# Altium schematic sheet driver_lift.SchDoc
size C
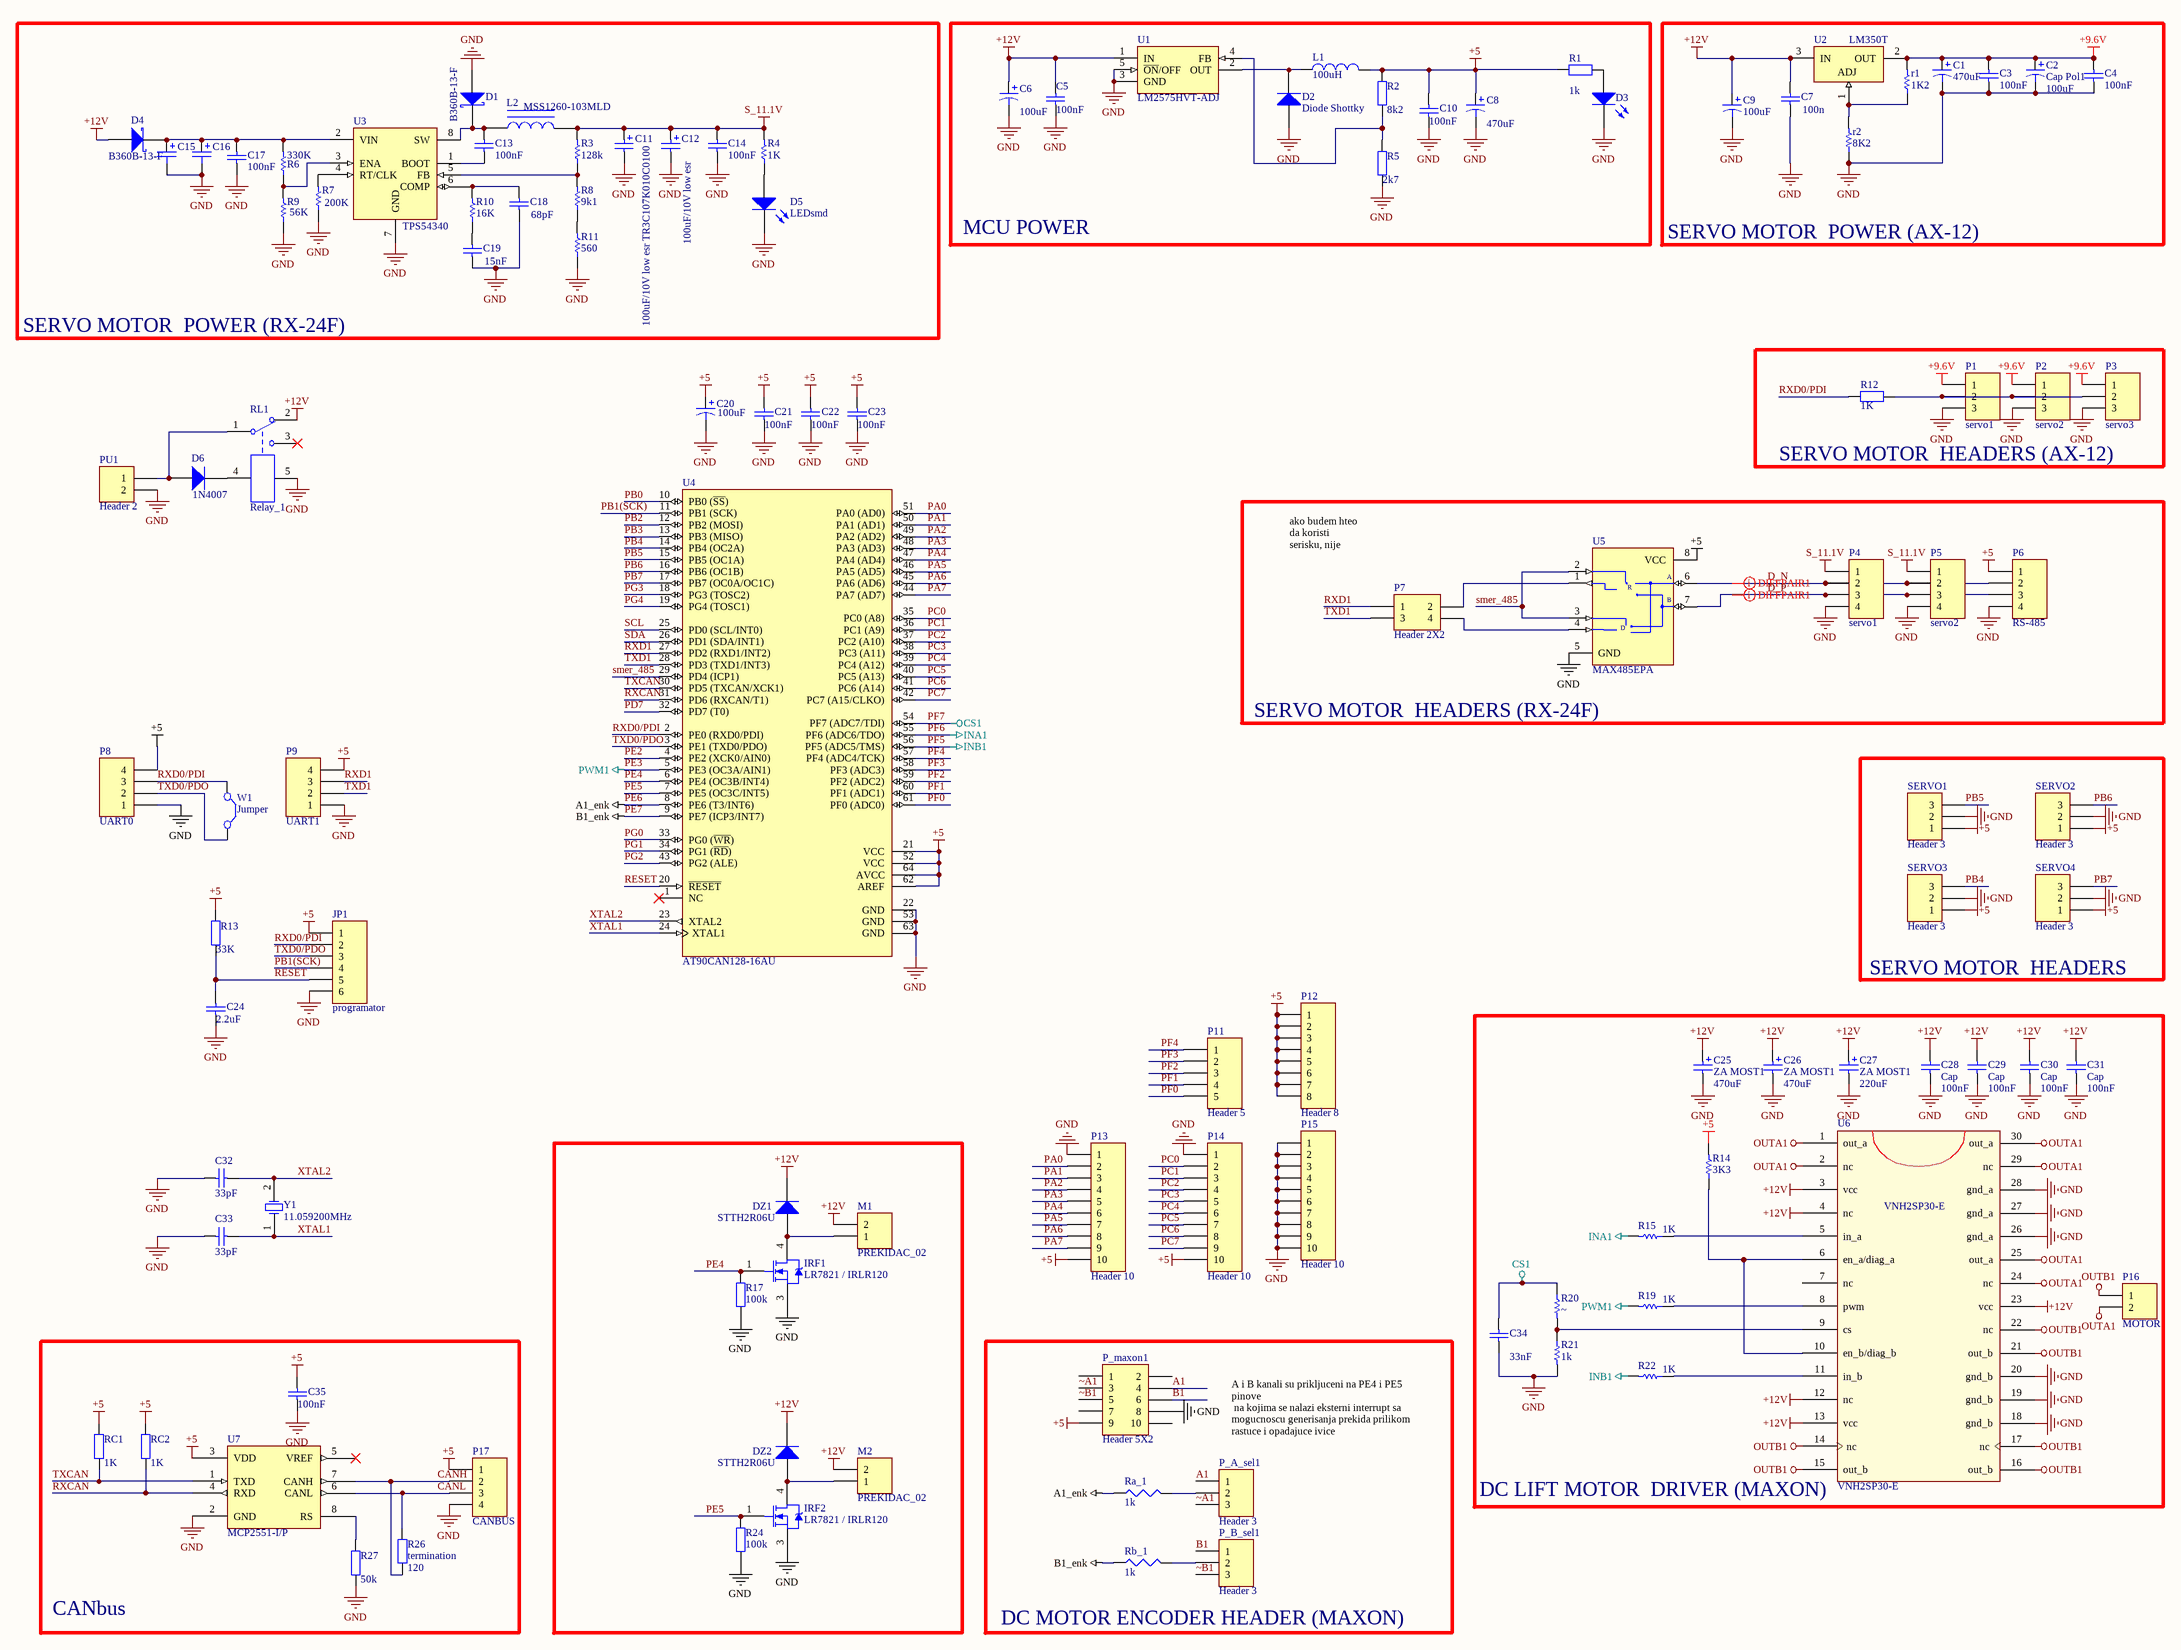
[diagram p0: driver_lift.SchDoc]

## Parts
(Parts that share a designator on the sheet are numbered #1, #2 ... from top to bottom, then left to right.)
C1  value 470uF  [B]  (hidden comment: Cap Pol1)
C2  Cap Pol1  value 100uF  [B]
C3  value 100nF  [1206]  (hidden comment: Cap)
C4  value 100nF  [1206]  (hidden comment: Cap)
C5  100nF  [1206]
C6  100uF  [B]
C7  value 100n  [1206]  (hidden comment: Cap)
C8  470uF  [CAPPR5-5x5]
C9  100uF  [B]
C10  100nF  [1206]
C11  value 100uF/10V low esr TR3C107K010C0100  [TC7343-2917]  (hidden comment: CapTantalum)
C12  value 100uF/10V low esr  [TC7343-2917]  (hidden comment: Cap Pol2)
C13  value 100nF  [1206_cap]  (hidden comment: cap_smd1206)
C14  value 100nF  [1206_cap]  (hidden comment: cap_smd1206)
C15  cap-smd1812  [cap_smd1812]  (value not drawn)
C16  cap-smd1812  [cap_smd1812]  (value not drawn)
C17  100nF  [1206_cap]
C18  value 68pF  [1206_cap]  (hidden comment: cap_smd1206)
C19  value 15nF  [1206_cap]  (hidden comment: cap_smd1206)
C20  100uF  [B]
C21  100nF  [1206]
C22  100nF  [1206]
C23  100nF  [1206]
C24  2.2uF  [1206]
C25  ZA MOST1  value 470uF  [DSO-C2/X2.3]
C26  ZA MOST1  value 470uF  [DSO-C2/X2.3]
C27  ZA MOST1  value 220uF  [DSO-C2/X2.3]
C28  Cap  value 100nF  [1206]
C29  Cap  value 100nF  [1206]
C30  Cap  value 100nF  [1206]
C31  Cap  value 100nF  [1206]
C32  33pF  [1206]
C33  33pF  [1206]
C34  value 33nF  [1206]  (hidden comment: Cap)
C35  100nF  [1206]
D1  B360B-13-F  [DSO-C2/X3.3]
D2  Diode Shottky  [DO-41]
D3  LED3  [1206]  (value not drawn)
D4  B360B-13-F  [DSO-C2/X3.3]
D5  LEDsmd  [led1206]
D6  1N4007  [DO-41]
DZ1  STTH2R06U  [DSO-C2/X2.3]
DZ2  STTH2R06U  [DSO-C2/X2.3]
IRF1  LR7821 / IRLR120  [TO252]
IRF2  LR7821 / IRLR120  [TO252]
JP1  programator  [HDR1X6]
L1  value 100uH  [AXIAL-0.4]  (hidden comment: Inductor)
L2  value MSS1260-103MLD  [INDUCTOR_SS1260-103MLD]  (hidden comment: Inductor_MSS1260)
M1  PREKIDAC_02  [kombinacija]
M2  PREKIDAC_02  [kombinacija]
P1  servo1  [HDR1X3]
P2  servo2  [HDR1X3]
P3  servo3  [HDR1X3]
P4  servo1  [HDR1X4]
P5  servo2  [HDR1X4]
P6  RS-485  [HDR1X4]
P7  Header 2X2  [HDR2X2]
P8  UART0  [HDR1X4]
P9  UART1  [HDR1X4]
P11  Header 5  [HDR1X5]
P12  Header 8  [HDR1X8]
P13  Header 10  [HDR1X10]
P14  Header 10  [HDR1X10]
P15  Header 10  [HDR1X10]
P16  MOTOR1  [kombinacija]
P17  CANBUS  [HDR1X4]
P_A_sel1  Header 3  [HDR1X3]
P_B_sel1  Header 3  [HDR1X3]
P_maxon1  Header 5X2  [box_header]
PU1  Header 2  [kon-zakacaljkax2]
R1#1  1k  [1206]
r1#2  value 1K2  [1206]  (hidden comment: Res1)
R2#1  8k2  [1206]
r2#2  value 8K2  [1206]  (hidden comment: Res1)
R3  value 128k  [1206_res]  (hidden comment: res)
R4  value 1K  [1206_res]  (hidden comment: res)
R5  2k7  [1206]
R6  value 330K  [1206_res]  (hidden comment: res)
R7  value 200K  [1206_res]  (hidden comment: res)
R8  value 9k1  [1206_res]  (hidden comment: res)
R9  value 56K  [1206_res]  (hidden comment: res)
R10  value 16K  [1206_res]  (hidden comment: res)
R11  value 560  [1206_res]  (hidden comment: res)
R12  value 1K  [1206]  (hidden comment: Res2)
R13  33k  [1206]
R14  value 3K3  [1206]  (hidden comment: res)
R15  value 1K  [1206]  (hidden comment: res)
R17  value 100k  [1206]  (hidden comment: Res2)
R19  value 1K  [1206]  (hidden comment: res)
R20  value ~  [1206]  (hidden comment: res)
R21  value 1k  [1206]  (hidden comment: res)
R22  value 1K  [1206]  (hidden comment: res)
R24  value 100k  [1206]  (hidden comment: Res2)
R26  termination  value 120  [1206]
R27  50k  [1206]
Ra_1  1k  [1206]
Rb_1  1k  [1206]
RC1  1K  [1206]
RC2  1k  [1206]
RL1  Relay_1  [RELEJ SMRDLJIVI]
SERVO1  Header 3  [HDR1X3]
SERVO2  Header 3  [HDR1X3]
SERVO3  Header 3  [HDR1X3]
SERVO4  Header 3  [HDR1X3]
U1  LM2575HVT-ADJ  [TO-263(5)]
U2  LM350T  [T03B]
U3  TPS54340  [SOIC_8PIN]
U4  AT90CAN128-16AU  [TQFP80P1600X1600X110-64L]
U5  MAX485EPA  [DIP-8]
U6  VNH2SP30-E  [vnh_test1]
U7  MCP2551-I/P  [SOIC_8PIN]
W1  Jumper  [RAD-0.1]
Y1  11.059200MHz  [RAD-0.2]

## Blocks framed on the sheet
SERVO MOTOR  POWER (RX-24F): C11-C19 D1 D4 D5 L2 R3 R4 R6-R11 U3
MCU POWER: C5 C6 C8 C10 D2 D3 L1 R1#1 R2#1 R5 U1
SERVO MOTOR  POWER (AX-12): C1-C4 C7 C9 r1#2 r2#2 U2
SERVO MOTOR  HEADERS (AX-12): P1-P3 R12
SERVO MOTOR  HEADERS (RX-24F): P4-P7 U5
SERVO MOTOR  HEADERS: SERVO1-SERVO4
DC LIFT MOTOR  DRIVER (MAXON): C25-C31 C34 P16 R14 R15 R19-R22 U6
CANbus: C35 P17 R26 R27 RC1 RC2 U7
DC MOTOR ENCODER HEADER (MAXON): P_A_sel1 P_B_sel1 P_maxon1 Ra_1 Rb_1

## Nets
+5: C8.1 C10.2 C20.1 C21.2 C22.2 C23.2 C35.2 JP1.1 L1.2 P6.1 P8.4 P9.4 P12.1 P12.2 P12.3 P12.4 P12.5 P12.6 P12.7 P12.8 P13.10 P14.10 P17.1 P_maxon1.9 R1#1.1 R2#1.2 R13.2 R14.2 RC1.2 RC2.2 SERVO1.1 SERVO2.1 SERVO3.1 SERVO4.1 U4.21(VCC) U4.52(VCC) U4.62(AREF) U4.64(AVCC) U5.8(VCC) U7.3(VDD)
+9.6V: C1.1 C2.1 C3.2 C4.2 P1.1 P2.1 P3.1 r1#2.2 U2.2(OUT)
+12V: C5.2 C6.1 C7.2 C9.1 C25.1 C26.1 C27.1 C28.2 C29.2 C30.2 C31.2 D4.1(A) DZ1.2(K) DZ2.2(K) M1.2 M2.2 RL1.2 U1.1(IN) U2.3(IN) U6.3(vcc) U6.4(nc) U6.12(nc) U6.13(vcc) U6.23(vcc)
GND: C1.2 C2.2 C3.1 C4.1 C5.1 C6.2 C7.1 C8.2 C9.2 C10.1 C11.2 C12.2 C14.1 C15.2 C16.2 C17.1 C18.1 C19.1 C20.2 C21.1 C22.1 C23.1 C24.1 C25.2 C26.2 C27.2 C28.1 C29.1 C30.1 C31.1 C32.2 C33.2 C34.1 C35.1 D1.1(A) D2.1(A) D3.2(K) D5.2(K) IRF1.3(S) IRF2.3(S) JP1.6 P1.3 P2.3 P3.3 P4.4 P5.4 P6.4 P8.1 P9.1 P13.1 P14.1 P15.1 P15.2 P15.3 P15.4 P15.5 P15.6 P15.7 P15.8 P15.9 P15.10 P17.4 P_maxon1.8 PU1.2 r2#2.1 R5.1 R7.1 R9.1 R11.1 R17.2 R21.2 R24.2 R27.1 RL1.5 SERVO1.2 SERVO2.2 SERVO3.2 SERVO4.2 U1.3(GND) U1.5(~{ON}/OFF) U3.7(GND) U4.22(GND) U4.53(GND) U4.63(GND) U5.5(GND) U6.18(gnd_b) U6.19(gnd_b) U6.20(gnd_b) U6.26(gnd_a) U6.27(gnd_a) U6.28(gnd_a) U7.2(GND)
OUTA1: P16.2 U6.1(out_a) U6.2(nc) U6.24(nc) U6.25(out_a) U6.29(nc) U6.30(out_a)
OUTB1: P16.1 U6.14(nc) U6.15(out_b) U6.16(out_b) U6.17(nc) U6.21(out_b) U6.22(nc)
PE3: R19.2 U4.5(PE3_(OC3A/AIN1))  [also labelled PWM1]
PE6: Ra_1.1 U4.8(PE6_(T3/INT6))  [also labelled A1_enk]
PE7: Rb_1.1 U4.9(PE7_(ICP3/INT7))  [also labelled B1_enk]
PF5: R22.2 U4.56(PF5_(ADC5/TMS))  [also labelled INB1]
PF6: R15.2 U4.55(PF6_(ADC6/TDO))  [also labelled INA1]
PF7: C34.2 R20.1 U4.54(PF7_(ADC7/TDI))  [also labelled CS1]
S_11.1V: C11.1 C12.1 C14.2 L2.2 P4.1 P5.1 R3.2 R4.2
A1: P_A_sel1.1 P_maxon1.4
B1: P_B_sel1.1 P_maxon1.6
CANH: P17.2 R26.2 U7.7(CANH)
CANL: P17.3 R26.1 U7.6(CANL)
D_N: P4.2 P5.2 P6.2 U5.6(A)
D_P: P4.3 P5.3 P6.3 U5.7(B)
PA0: P13.2 U4.51(PA0_(AD0))
PA1: P13.3 U4.50(PA1_(AD1))
PA2: P13.4 U4.49(PA2_(AD2))
PA3: P13.5 U4.48(PA3_(AD3))
PA4: P13.6 U4.47(PA4_(AD4))
PA5: P13.7 U4.46(PA5_(AD5))
PA6: P13.8 U4.45(PA6_(AD6))
PA7: P13.9 U4.44(PA7_(AD7))
PB0: U4.10(PB0_(~{SS}))
PB1(SCK): JP1.4 U4.11(PB1_(SCK))
PB2: U4.12(PB2_(MOSI))
PB3: U4.13(PB3_(MISO))
PB4: SERVO3.3 U4.14(PB4_(OC2A))
PB5: SERVO1.3 U4.15(PB5_(OC1A))
PB6: SERVO2.3 U4.16(PB6_(OC1B))
PB7: SERVO4.3 U4.17(PB7_(OC0A/OC1C))
PC0: P14.2 U4.35(PC0_(A8))
PC1: P14.3 U4.36(PC1_(A9))
PC2: P14.4 U4.37(PC2_(A10))
PC3: P14.5 U4.38(PC3_(A11))
PC4: P14.6 U4.39(PC4_(A12))
PC5: P14.7 U4.40(PC5_(A13))
PC6: P14.8 U4.41(PC6_(A14))
PC7: P14.9 U4.42(PC7_(A15/CLKO))
PD7: U4.32(PD7_(T0))
PE2: U4.4(PE2_(XCK0/AIN0))
PE4: IRF1.1(G) R17.1 U4.6(PE4_(OC3B/INT4))
PE5: IRF2.1(G) R24.1 U4.7(PE5_(OC3C/INT5))
PF0: P11.5 U4.61(PF0_(ADC0))
PF1: P11.4 U4.60(PF1_(ADC1))
PF2: P11.3 U4.59(PF2_(ADC2))
PF3: P11.2 U4.58(PF3_(ADC3))
PF4: P11.1 U4.57(PF4_(ADC4/TCK))
PG0: U4.33(PG0_(~{WR}))
PG1: U4.34(PG1_(~{RD}))
PG2: U4.43(PG2_(ALE))
PG3: U4.18(PG3_(TOSC2))
PG4: U4.19(PG4_(TOSC1))
RESET: C24.2 JP1.5 R13.1 U4.20(~{RESET})
RXCAN: RC2.1 U4.31(PD6_(RXCAN/T1)) U7.4(RXD)
RXD0/PDI: JP1.2 P8.3 R12.1 U4.2(PE0_(RXD0/PDI)) W1.1(C1)
RXD1: P7.1 P9.3 U4.27(PD2_(RXD1/INT2))
SCL: U4.25(PD0_(SCL/INT0))
SDA: U4.26(PD1_(SDA/INT1))
smer_485: U4.29(PD4_(ICP1)) U5.2(~{RE}) U5.3(DE)
TXCAN: RC1.1 U4.30(PD5_(TXCAN/XCK1)) U7.1(TXD)
TXD0/PDO: JP1.3 P8.2 U4.3(PE1_(TXD0/PDO)) W1.2(C2)
TXD1: P7.3 P9.2 U4.28(PD3_(TXD1/INT3))
XTAL1: C33.1 U4.24(XTAL1) Y1.1(OSC1)
XTAL2: C32.1 U4.23(XTAL2) Y1.2(OSC2)
~A1: P_A_sel1.3 P_maxon1.3
~B1: P_B_sel1.3 P_maxon1.5
NetC13_1: C13.1 U3.1(BOOT)
NetC13_2: C13.2 D1.2(K) L2.1 U3.8(SW)
NetC15_1: C15.1 C16.1 C17.2 D4.2(K) R6.2 U3.2(VIN)
NetC18_2: C18.2 R10.2 U3.6(COMP)
NetC19_2: C19.2 R10.1
NetD2_2: D2.2(K) L1.1 U1.2(OUT)
NetD3_1: D3.1(A) R1#1.2
NetD5_1: D5.1(A) R4.1
NetD6_1: D6.1(A) PU1.1 RL1.1
NetD6_2: D6.2(K) RL1.4
NetDZ1_1: DZ1.1(A) IRF1.4(D) M1.1
NetDZ2_1: DZ2.1(A) IRF2.4(D) M2.1
NetP1_2: P1.2 P2.2 P3.2 R12.2
NetP7_2: P7.2 U5.1(RO)
NetP7_4: P7.4 U5.4(DI)
NetP_A_sel1_2: P_A_sel1.2 Ra_1.2
NetP_B_sel1_2: P_B_sel1.2 Rb_1.2
Netr1#2_1: r1#2.1 r2#2.2 U2.1(ADJ)
NetR2#1_1: R2#1.1 R5.2 U1.4(FB)
NetR3_1: R3.1 R8.2 U3.5(FB)
NetR6_1: R6.1 R9.2 U3.3(ENA)
NetR7_2: R7.2 U3.4(RT/CLK)
NetR8_1: R8.1 R11.2
NetR14_1: R14.1 U6.6(en_a/diag_a) U6.10(en_b/diag_b)
NetR15_1: R15.1 U6.5(in_a)
NetR19_1: R19.1 U6.8(pwm)
NetR20_2: R20.2 R21.1 U6.9(cs)
NetR22_1: R22.1 U6.11(in_b)
NetR27_2: R27.2 U7.8(RS)

Not connected (* = marked no-connect by the designer): P_maxon1 1 2 7 10; RL1 3*; U4 1(NC)*; U6 7(nc); U7 5(VREF)*

## Layout directives
differential pair: D_N, D_P

## Notes on the sheet
- ako budem hteo da koristi serisku, nije definisan smer, pa brljavi
- (near P_A_sel1) A i B kanali su prikljuceni na PE4 i PE5 pinove
  na kojima se nalazi eksterni interrupt sa mogucnoscu generisanja prekida prilikom rastuce i opadajuce ivice
- (in symbol MAX485EPA) R; D

## Library data of the parts
C1 C2 C6 C8 C9 C20 C25-C27 = Cap Pol1: Polarized Capacitor (Radial); Published: 8-Jun-2000; LatestRevisionDate: 17-Jul-2002; LatestRevisionNote: Re-released for DXP Platform.; PackageReference: RB7.6-15; Publisher: Altium Limited
  C6 C9 C20: Value: 100uF
  C8: Value: 470uF
C3-C5 C7 C10 C21-C24 C28-C35 = Cap: Capacitor; Published: 8-Jun-2000; Publisher: Altium Limited
  C3 C4: Revision: July-2002: Re-released for DXP Platform.
  C5 C10 C21-C23 C35: LatestRevisionDate: 17-Jul-2002; LatestRevisionNote: Re-released for DXP Platform.; PackageReference: RAD-0.3; Value: 100nF
  C7 C28-C31 C34: LatestRevisionDate: 17-Jul-2002; LatestRevisionNote: Re-released for DXP Platform.; PackageReference: RAD-0.3
  C24: LatestRevisionDate: 17-Jul-2002; LatestRevisionNote: Re-released for DXP Platform.; PackageReference: RAD-0.3; Value: 2.2uF
  C32 C33: LatestRevisionDate: 17-Jul-2002; LatestRevisionNote: Re-released for DXP Platform.; PackageReference: RAD-0.3; Value: 33pF
C11 = CapTantalum: Polarized Capacitor (Radial); Published: 8-Jun-2000; LatestRevisionDate: 17-Jul-2002; LatestRevisionNote: Re-released for DXP Platform.; PackageReference: RB7.6-15; Publisher: Altium Limited
C12 = Cap Pol2: Polarized Capacitor (Axial); Published: 8-Jun-2000; LatestRevisionDate: 17-Jul-2002; LatestRevisionNote: Re-released for DXP Platform.; PackageReference: POLAR0.8; Publisher: Altium Limited; PackageDescription: Polarized Capacitor; 2 Leads
C13 C14 C18 C19 = cap_smd1206: Capacitor; Published: 8-Jun-2000; LatestRevisionDate: 17-Jul-2002; LatestRevisionNote: Re-released for DXP Platform.; PackageReference: RAD-0.3; Publisher: Altium Limited
C15 C16 = cap-smd1812: Polarized Capacitor (Axial); Value: X7R; Published: 8-Jun-2000; LatestRevisionDate: 17-Jul-2002; LatestRevisionNote: Re-released for DXP Platform.; PackageReference: POLAR0.8; Publisher: Altium Limited; PackageDescription: Polarized Capacitor; 2 Leads
C17 = cap_smd: Capacitor; Published: 8-Jun-2000; LatestRevisionDate: 17-Jul-2002; LatestRevisionNote: Re-released for DXP Platform.; PackageReference: RAD-0.3; Publisher: Altium Limited
D1 D4 = SCHOTTKY_RECTIFIER_diode_SMB: Schottky Rectifier; Published: 8-Jun-2000; LatestRevisionDate: 17-Jul-2002; LatestRevisionNote: Re-released for DXP Platform.; DatasheetDocument: Dec-1997; PackageReference: DO-204AL; Publisher: Altium Limited; Code_JEDEC: DO-204-AL; ComponentLink1Description: Manufacturer Link; ComponentLink1URL: http://www.irf.com/; ComponentLink2Description: Datasheet; ComponentLink2URL: http://www.irf.com/product-info/datasheets/data/11dq03.pdf
D2 D6 = Diode 1N4007: 1 Amp General Purpose Rectifier; Published: 8-Jun-2000; LatestRevisionDate: 17-Jul-2002; LatestRevisionNote: Re-released for DXP Platform.; PackageReference: DO-41; Publisher: Altium Limited; Code_JEDEC: DO-204-AL; ComponentLink1Description: Manufacturer Link; ComponentLink1URL: http://www.fairchildsemi.com/; ComponentLink2Description: Datasheet; ComponentLink2URL: http://www.fairchildsemi.com/ds/1N%2F1N4001.pdf
  D2: DatasheetDocument: 1998; PackageDocument: Aug-1999
  D6: DatasheetVersion: 1998; PackageVersion: Aug-1999
D3 = LED3: Typical BLUE SiC LED; Published: 8-Jun-2000; LatestRevisionDate: 17-Dec-2003; LatestRevisionNote: PCB Footprint replaced.; DatasheetDocument: 16-Apr-2002; PackageDocument: 16-Apr-2002; PackageReference: 3.5X2.8X1.9; Publisher: Altium Limited
D5 = LEDsmd: Typical INFRARED GaAs LED; Published: 8-Jun-2000; LatestRevisionDate: 08-Jul-2005; LatestRevisionNote: Mech Layer 1 removed.; PackageReference: LED-0; Publisher: Altium Limited
DZ1 DZ2 = Diode: Default Diode; Published: 8-Jun-2000; LatestRevisionDate: 17-Jul-2002; LatestRevisionNote: Re-released for DXP Platform.; PackageDocument: Sep-1996; PackageReference: SMC; Publisher: Altium Limited; Code_JEDEC: DO-214-AB
IRF1 IRF2 = IRLR120: HEXFET N-Channel Power MOSFET; Note: Pin 2 is trimmed and is electrically connected to Drain.; Published: 8-Jun-2000; LatestRevisionDate: 20-Nov-2009; LatestRevisionNote: IPC-7351 Footprint Added.; DatasheetVersion: PD-9.636A; PackageVersion: Feb-2003; PackageReference: TO-252AA; Publisher: Altium Limited; PackageDescription: 3-Pin HEXFET Package 2.28 mm Pitch, 9.9 mm Lead Span; Code_JEDEC: TO-252-AA; ComponentLink1Description: Manufacturer Link; ComponentLink1URL: http://www.irf.com/; ComponentLink2Description: Datasheet; ComponentLink2URL: http://www.irf.com/product-info/datasheets/data/irlr120.pdf
JP1 = Header 6: Header, 6-Pin; LatestRevisionDate: 17-Jul-2002; LatestRevisionNote: Re-released for DXP Platform.; Publisher: Altium Limited
L1 = Inductor: Code_IEC: 1005; Published: 8-Jun-2000; LatestRevisionDate: 17-Jul-2002; LatestRevisionNote: Re-released for DXP Platform.; PackageReference: 0402-A; Publisher: Altium Limited; Code_JEITA: 0402
L2 = Inductor_MSS1260: Magnetic-Core Inductor; Published: 24-Mar-1999; LatestRevisionDate: 17-Jul-2002; LatestRevisionNote: Re-released for DXP Platform.; PackageReference: AXIAL-0.9; Publisher: Altium Limited; PackageDescription: Axial Device, Thru-Hole; 2 Leads; 0.9 in Pin Spacing
M1 M2 P16 PU1 = Header 2: Header, 2-Pin; LatestRevisionDate: 17-Jul-2002; LatestRevisionNote: Re-released for DXP Platform.; Publisher: Altium Limited
P1-P3 P_A_sel1 P_B_sel1 SERVO1-SERVO4 = Header 3: Header, 3-Pin; LatestRevisionDate: 17-Jul-2002; LatestRevisionNote: Re-released for DXP Platform.; Publisher: Altium Limited
P4-P6 P8 P9 P17 = Header 4: Header, 4-Pin; LatestRevisionDate: 17-Jul-2002; LatestRevisionNote: Re-released for DXP Platform.; Publisher: Altium Limited
P7 = Header 2X2: Header, 2-Pin, Dual row; LatestRevisionDate: 17-Jul-2002; LatestRevisionNote: Re-released for DXP Platform.; Publisher: Altium Limited
P11 = Header 5: Header, 5-Pin; LatestRevisionDate: 17-Jul-2002; LatestRevisionNote: Re-released for DXP Platform.; Publisher: Altium Limited
P12 = Header 8: Header, 8-Pin; LatestRevisionDate: 17-Jul-2002; LatestRevisionNote: Re-released for DXP Platform.; Publisher: Altium Limited
P13-P15 = Header 10: Header, 10-Pin; LatestRevisionDate: 17-Jul-2002; LatestRevisionNote: Re-released for DXP Platform.; Publisher: Altium Limited
P_maxon1 = Header 5X2: Header, 5-Pin, Dual row; LatestRevisionDate: 17-Jul-2002; LatestRevisionNote: Re-released for DXP Platform.; Publisher: Altium Limited
R1#1 R2#1 R5 R12 R13 R17 R24 R26 R27 RC1 RC2 = Res2: Resistor; Published: 8-Jun-2000; LatestRevisionDate: 17-Jul-2002; LatestRevisionNote: Re-released for DXP Platform.; PackageReference: AXIAL-0.4; Publisher: Altium Limited
  R1#1: Value: 1k
  R2#1: Value: 8k2
  R5: Value: 2k7
  R13: Value: 33K
  R27: Value: 50k
  RC1 RC2: Value: 1K
r1#2 r2#2 R14 R15 R19-R22 = Res1: Resistor; Published: 8-Jun-2000; LatestRevisionDate: 17-Jul-2002; LatestRevisionNote: Re-released for DXP Platform.; PackageReference: AXIAL-0.3; Publisher: Altium Limited
R3 R4 R6-R11 = res: Resistor; Published: 8-Jun-2000; LatestRevisionDate: 17-Jul-2002; LatestRevisionNote: Re-released for DXP Platform.; PackageReference: AXIAL-0.3; Publisher: Altium Limited
Ra_1 Rb_1 = RES1
U1 = LM2575HVT-ADJ: Simple Switcher 1A Step Down Voltage Regulator; Note: Tab is connected to GND; Published: 15-Apr-2002; DatasheetVersion: May-1999; PackageVersion: 2000; PackageReference: T05A; Publisher: Altium Limited; PackageDescription: TO, Thru-Hole, Vertical, Heatsink Mounted; 5 In-Line Leads; Pitch 1.70 mm; Code_JEDEC: TS-001-AA; ComponentLink1Description: Manufacturer Link; ComponentLink1URL: http://www.national.com/; ComponentLink2Description: Datasheet; ComponentLink2URL: http://www.national.com/ds.cgi/LM/LM1575.pdf; ComponentLink3Description: URL Link1; ComponentLink3URL: http://www.national.com/pf/LM/LM2575HV.html
U2 = LM350T: 3-Amp Adjustable Regulator; Manufacturer: National Semiconductor; CompType: LDO IC; PackageTopMarking: NSUZXYTTE#*LM350T P+; PowerWise: N; Published: 4-Dec-2008; DatasheetVersion: May-1998; PackageVersion: revL, Jan-1992; PackageReference: T03B; Publisher: Altium Limited; PackageDescription: TO-220, Molded, 3 Lead, Straight; PartNumber: LM350T; RoHS: O; PinCount: 3; DigiKeyPartNumber: LM350TNS-ND; ComponentLink1Description: LM350 Datasheet; ComponentLink1URL: http://www.national.com/ds/LM/LM350.pdf; ComponentLink2Description: LM350 Web Page; ComponentLink2URL: http://www.national.com/pf/LM/LM350.html; ComponentLink3Description: T03B Package Page; ComponentLink3URL: http://www.national.com/packaging/folders/t03b.html
U3 = TPS54340: Buck Step Down Regulator with 5.5 to 36 V Input and 1.23 to 31 V Output, -40 to 125 degC, 8-Pin SOIC (D), Green (RoHS & no Sb/Br); PartNumber: TPS5420DG4; Manufacturer: Texas Instruments; Duty Cycle(Max)(%): 87; Iout(Max)(A): 2; Iq(Typ)(mA): 3; Rating: Catalog; Regulated Outputs(#): 1; SubFamily: Step-Down Regulator; Vin(Max)(V): 36; Vin(Min)(V): 5.5; Vout(Max)(V): 31; Vout(Min)(V): 1.23; DatasheetVersion: SLVS642C; PackageVersion: revM, Jun-2011; PackageReference: D8; PackageDescription: 8-Pin Plastic Small Outline Integrated Circuit, 4.9 x 3.9 mm, Pitch 1.27 mm Pitch; Supplier 1: Digi-Key; Supplier Part Number 1: TPS5420DG4-ND; Supplier 2: Farnell; Supplier Part Number 2: 1262365; Supplier 3: Newark; Supplier Part Number 3: 95M4483; Supplier 4: Newark; Supplier Part Number 4: 99K4407; Supplier 5: Mouser; Supplier Part Number 5: 595-TPS5420DG4; Eco-Plan: Green (RoHS & no Sb/Br); Switch Current Limit(Typ)(A): 3; Topology: Buck; Mounting Technology: Surface Mount; Code_JEDEC: MS-012AA; ComponentLink1Description: Datasheet; ComponentLink1URL: http://www.ti.com/general/docs/lit/getliterature.tsp?genericPartNumber=TPS5420&fileType=pdf; ComponentLink2Description: URL Link1; ComponentLink2URL: Samples URL:http://www.ti.com/product/tps5420#samples
U4 = AT90CAN128-16AU: 8-bit AVR Microcontroller, 128KB Flash and CAN Controller, 53 GPIO pins, Industrial Grade (-40° to +85°C), 64-pin LQFP, Green; Published: 1-Apr-2010; DatasheetVersion: revH, Aug-2008; PackageVersion: revB, Oct-2001; PackageReference: 64A; Publisher: Altium Limited; PackageDescription: 64-Pin Plastic Thin Profile Quad Flat Pack, 14 x 14 x 1.0 mm Body, 0.8 mm Pitch (TQFP); Supplier 1: Digi-Key; Supplier Part Number 1: AT90CAN128-16AU-ND; Supplier 2: Farnell; Supplier Part Number 2: 1661734; Supplier 3: Farnell; Supplier Part Number 3: 1455065; Supplier 4: Mouser; Supplier Part Number 4: 556-A90CAN128-16AU; Code_JEDEC: MS-026-AEB; ComponentLink1Description: Manufacturer Link; ComponentLink1URL: http://www.atmel.com/products/avr/default.asp?; ComponentLink2Description: AT90CAN32/64/128 Datasheet; ComponentLink2URL: http://www.atmel.com/dyn/resources/prod_documents/doc7679.pdf; ComponentLink3Description: AT90CAN32/64/128 Summary; ComponentLink3URL: http://www.atmel.com/dyn/resources/prod_documents/7679S.pdf; ComponentLink4Description: Atmel.com Home; ComponentLink4URL: http://www.atmel.com
U5 = MAX485EPA: Low-Power, Slew-Rate-Limited RS-485/RS-422 Transceiver; PackageDocument: RevB, 21-0043; Published: 16-Jan-2001; LatestRevisionDate: 6-Jun-2005; LatestRevisionNote: Stylized 3D Model Added.; DatasheetDocument: Feb-1996; PackageReference: PA8; Publisher: Altium Limited; Code_JEDEC: MS-001-AB; ComponentLink1Description: Manufacturer Link; ComponentLink1URL: http://www.maxim-ic.com/; ComponentLink2Description: Datasheet; ComponentLink2URL: http://pdfserv.maxim-ic.com/en/ds/MAX1487-MAX491.pdf
U7 = MCP2551-I/P: High Speed CAN Transceiver, 8-Pin Plastic DIP, Industrial Grade; Published: 6-Oct-2005; DatasheetVersion: Nov-2003; PackageVersion: Oct-2005; PackageReference: PDIP300-8; Publisher: Altium Limited; PackageDescription: DIP, Plastic; 8 Leads; Row Spacing 7.62 mm; Pitch 2.54 mm; Code_JEDEC: MS-001; ComponentLink1Description: Manufacturer Link; ComponentLink1URL: http://www.microchip.com; ComponentLink2Description: Datasheet; ComponentLink2URL: http://ww1.microchip.com/downloads/en/DeviceDoc/21667d.pdf
W1 = Jumper: Jumper Wire; Published: 24-Mar-1999; LatestRevisionDate: 17-Jul-2002; LatestRevisionNote: Re-released for DXP Platform.; PackageReference: RAD-0.2; Publisher: Altium Limited
Y1 = XTAL: Crystal Oscillator; Published: 8-Jun-2000; LatestRevisionDate: 17-Jul-2002; LatestRevisionNote: Re-released for DXP Platform.; PackageReference: R38; Publisher: Altium Limited